# Altium schematic sheet Arduino CAN shield sch_V1.0.SchDoc
size A4
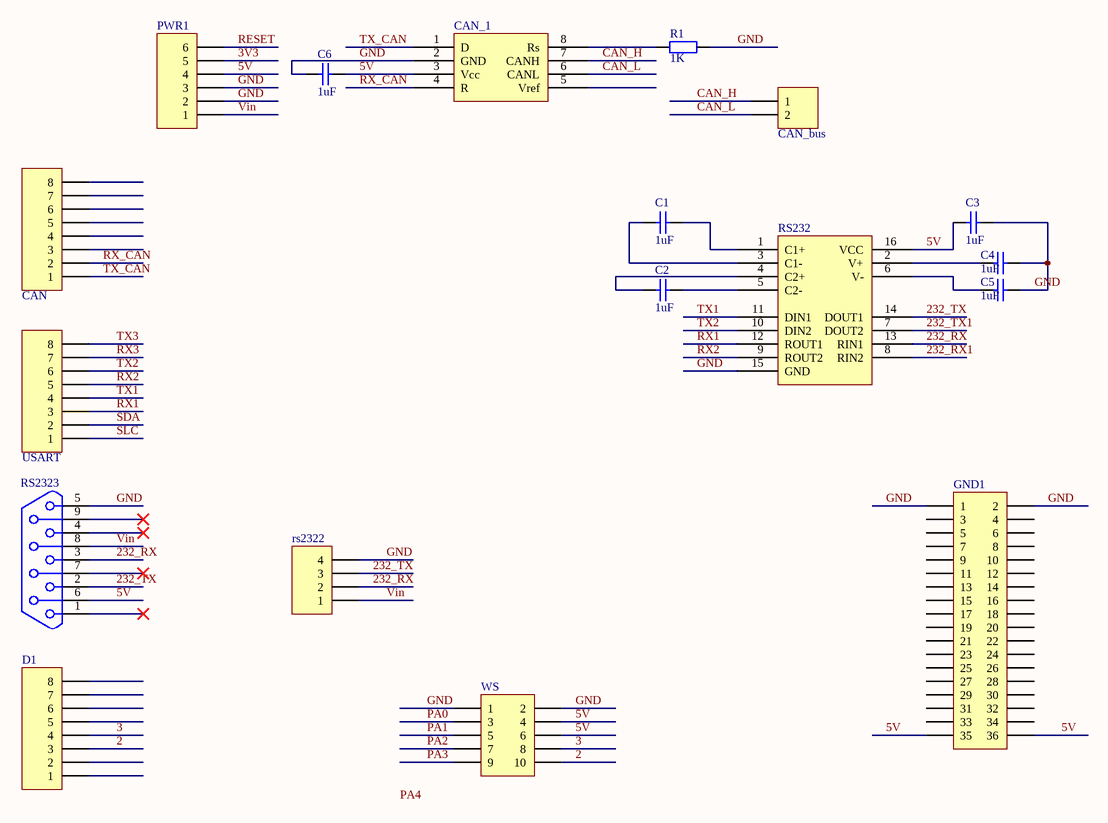
[diagram p0: Arduino CAN shield sch_V1.0.SchDoc]

## Parts
C1  1uF  [0805C]
C2  1uF  [0805C]
C3  1uF  [0805C]
C4  1uF  [0805C]
C5  1uF  [0805C]
C6  1uF  [0805C]
CAN  Header 8  [HDR1X8]  (value not drawn)
CAN_1  VP230  [SI4435]  (value not drawn)
CAN_bus  Header 2_3  [HDR1X2-can]  (value not drawn)
D1  Header 8  [HDR1X8]  (value not drawn)
GND1  Header 18X2H  [HDR2X18]  (value not drawn)
PWR1  Header 6_1  [HDR1X6]  (value not drawn)
R1  1K  [0805R]
RS232  MAX232D  [TSSOP-16]  (value not drawn)
rs2322  Header 4_1  [HDR1X4]  (value not drawn)
RS2323  DB9  [DB9RA/F]  (value not drawn)
USART  Header 8  [HDR1X8]  (value not drawn)
WS  Header 5X2_3  [HDR2X5]  (value not drawn)

## Nets
2: D1.3 WS.10
3: D1.4 WS.8
3V3: PWR1.5
5V: C3.1 C6.1 CAN_1.3(Vcc) GND1.35 GND1.36 PWR1.4 RS232.16(VCC) RS2323.6 WS.4 WS.6
232_RX: RS232.13(RIN1) rs2322.2 RS2323.3
232_RX1: RS232.8(RIN2)
232_TX: RS232.14(DOUT1) rs2322.3 RS2323.2
232_TX1: RS232.7(DOUT2)
CAN_H: CAN_1.7(CANH) CAN_bus.1
CAN_L: CAN_1.6(CANL) CAN_bus.2
GND: C3.2 C4.1 C5.1 C6.2 CAN_1.2(GND) GND1.1 GND1.2 PWR1.2 PWR1.3 R1.2 RS232.15(GND) rs2322.4 RS2323.5 WS.1 WS.2
PA0: WS.3
PA1: WS.5
PA2: WS.7
PA3: WS.9
RESET: PWR1.6
RX1: RS232.12(ROUT1) USART.3
RX2: RS232.9(ROUT2) USART.5
RX3: USART.7
RX_CAN: CAN.2 CAN_1.4(R)
SDA: USART.2
SLC: USART.1
TX1: RS232.11(DIN1) USART.4
TX2: RS232.10(DIN2) USART.6
TX3: USART.8
TX_CAN: CAN.1 CAN_1.1(D)
Vin: PWR1.1 rs2322.1 RS2323.8
NetC1_1: C1.1 RS232.1(C1+)
NetC1_2: C1.2 RS232.3(C1-)
NetC2_1: C2.1 RS232.5(C2-)
NetC2_2: C2.2 RS232.4(C2+)
NetC4_2: C4.2 RS232.2(V+)
NetC5_2: C5.2 RS232.6(V-)
NetCAN_1_8: CAN_1.8(Rs) R1.1

Not connected (* = marked no-connect by the designer): CAN 3 4 5 6 7 8; CAN_1 5(Vref); D1 1 2 5 6 7 8; GND1 3 4 5 6 7 8 9 10 11 12 13 14 15 16 17 18 19 20 21 22 23 24 25 26 27 28 29 30 31 32 33 34; RS2323 1* 4* 7* 9*

## Notes on the sheet
- Labels drawn without touching a wire or pin: PA4

## Library data of the parts
C1-C6 = Cap: Capacitor; Published: 8-Jun-2000; LatestRevisionDate: 17-Jul-2002; LatestRevisionNote: Re-released for DXP Platform.; PackageReference: RAD-0.3; Publisher: Altium Limited; Value: 1uF
CAN_bus = Header 2_3: Header, 2-Pin; LatestRevisionDate: 17-Jul-2002; LatestRevisionNote: Re-released for DXP Platform.; Publisher: Altium Limited
GND1 = Header 18X2H: Header, 18-Pin, Dual row, Right Angle; LatestRevisionDate: 17-Jul-2002; LatestRevisionNote: Re-released for DXP Platform.; Publisher: Altium Limited
PWR1 = Header 6_1: Header, 6-Pin; LatestRevisionDate: 17-Jul-2002; LatestRevisionNote: Re-released for DXP Platform.; Publisher: Altium Limited
R1 = Res2: Resistor; Published: 8-Jun-2000; LatestRevisionDate: 17-Jul-2002; LatestRevisionNote: Re-released for DXP Platform.; PackageReference: AXIAL-0.4; Publisher: Altium Limited; Value: 1K
rs2322 = Header 4_1: Header, 4-Pin; LatestRevisionDate: 17-Jul-2002; LatestRevisionNote: Re-released for DXP Platform.; Publisher: Altium Limited
WS = Header 5X2_3: Header, 5-Pin, Dual row; LatestRevisionDate: 17-Jul-2002; LatestRevisionNote: Re-released for DXP Platform.; Publisher: Altium Limited